# Altium schematic sheet T 1500  B.SchDoc
size 711 x 457 mm
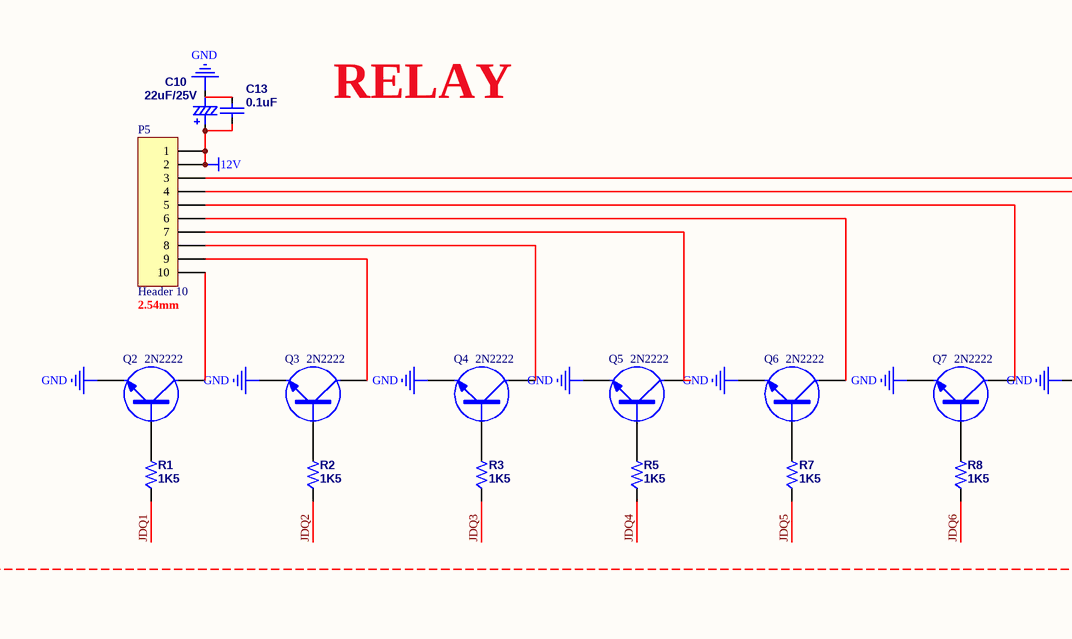
[diagram p0: T 1500  B.SchDoc, top left]
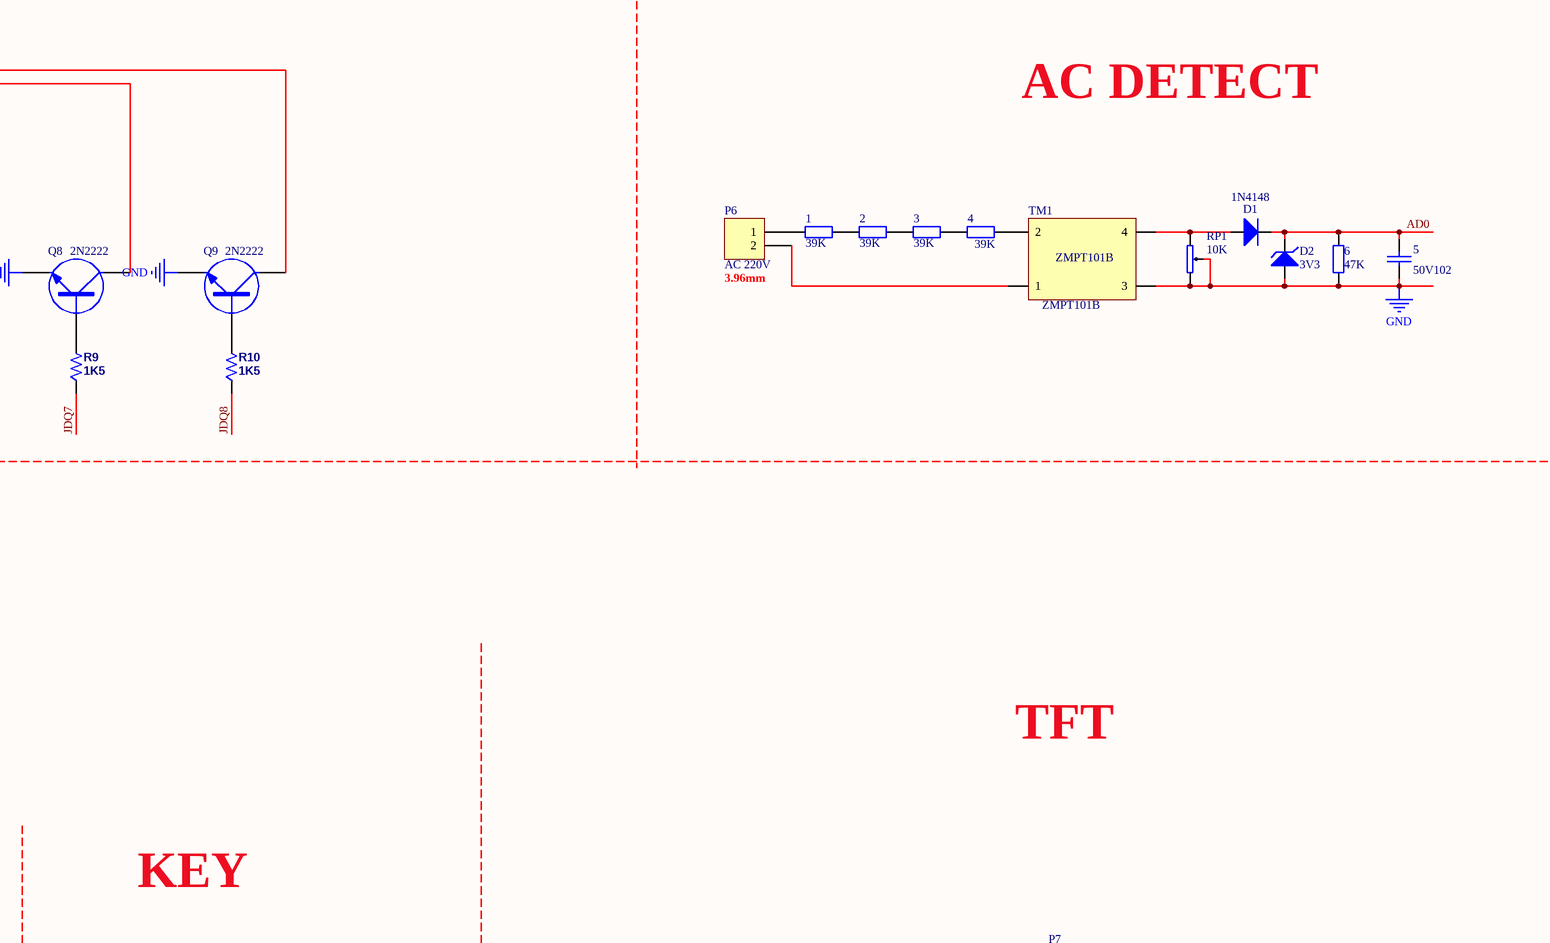
[diagram p1: T 1500  B.SchDoc, top right]
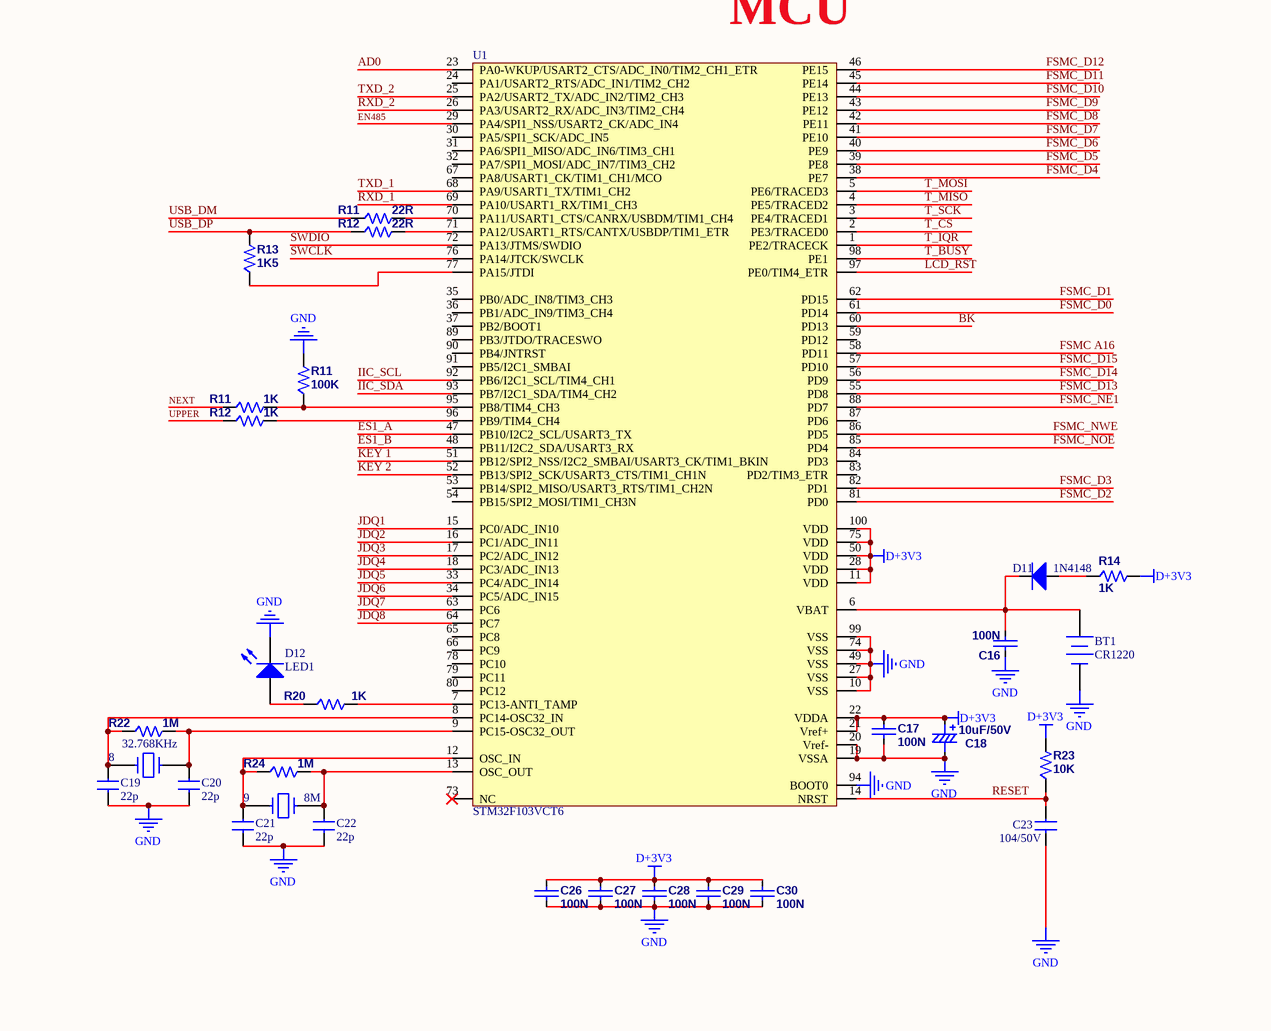
[diagram p2: T 1500  B.SchDoc, bottom left]
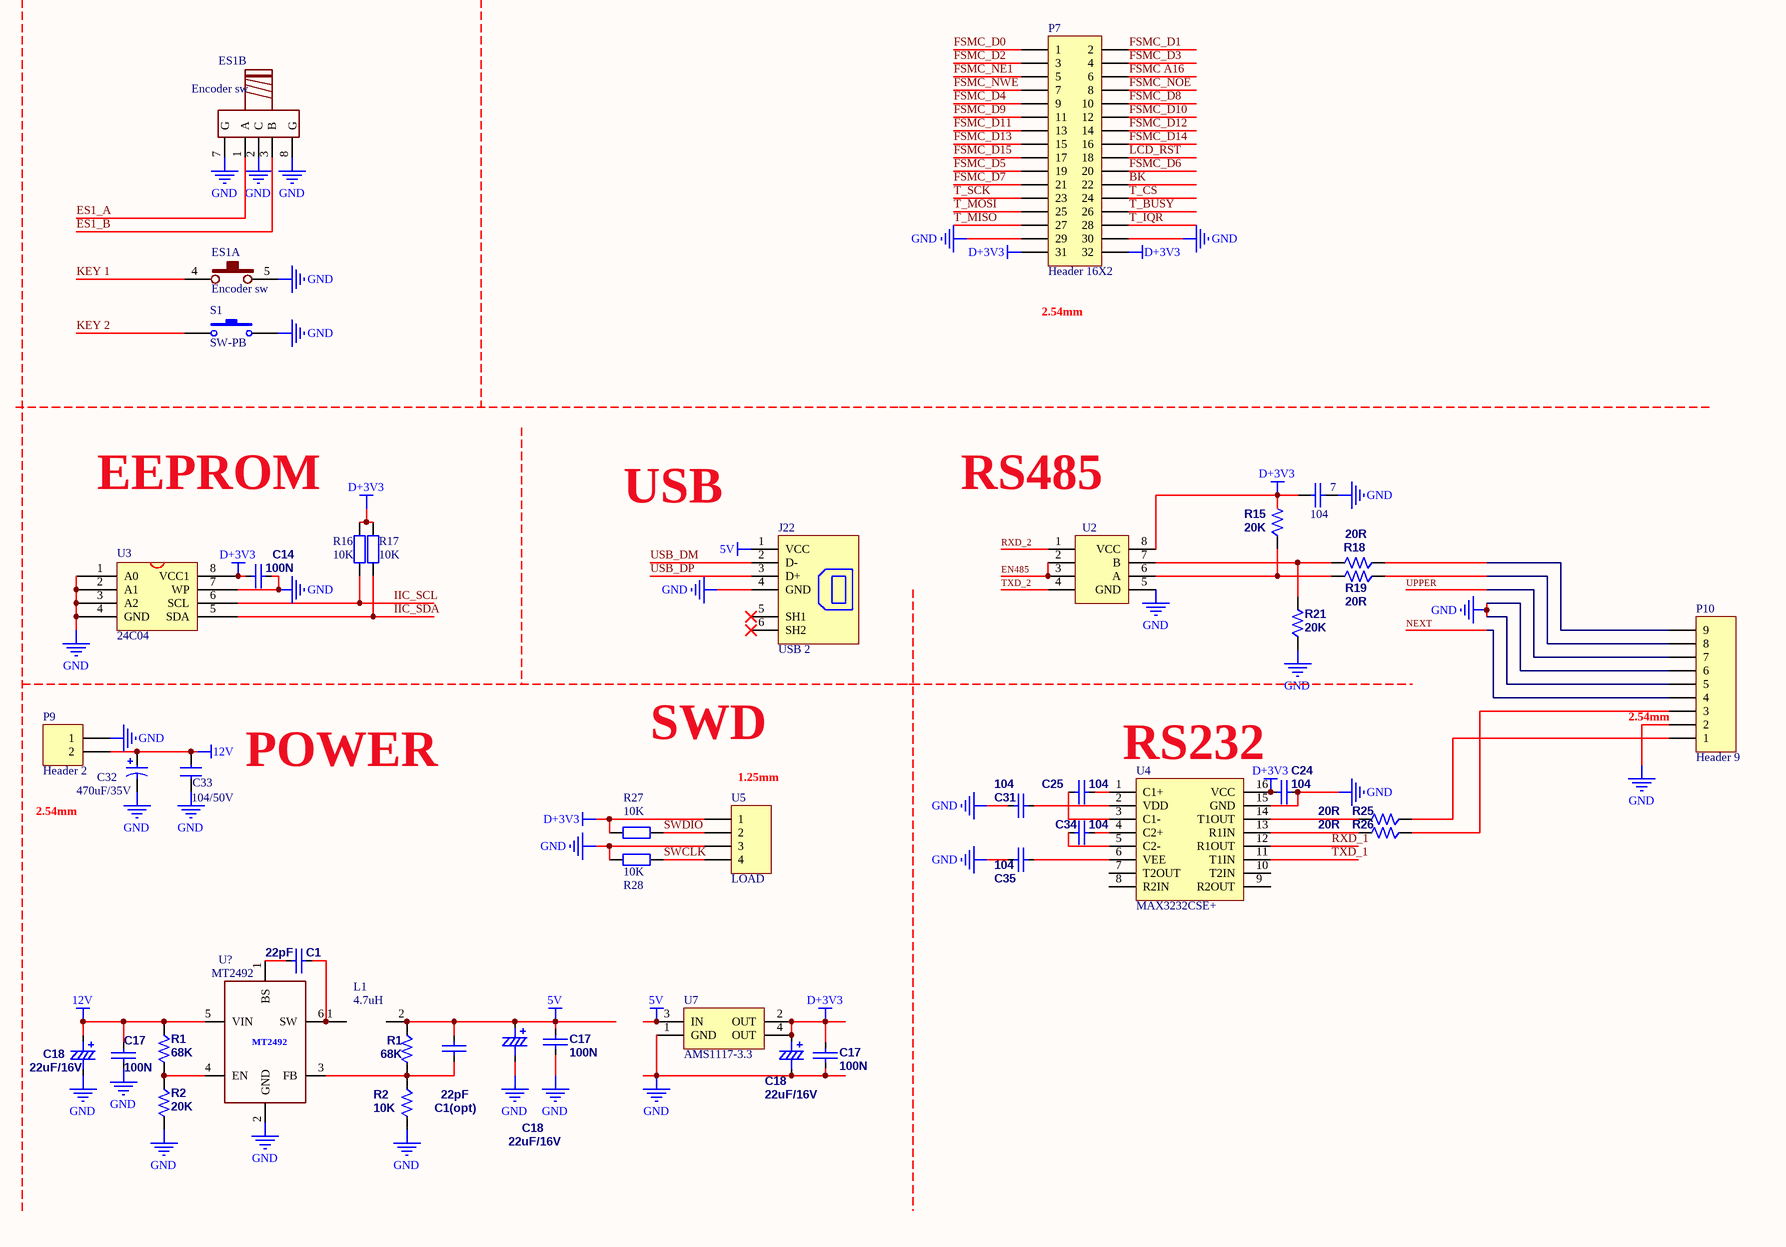
[diagram p3: T 1500  B.SchDoc, bottom right]

## Parts
(Parts that share a designator on the sheet are numbered #1, #2 ... from top to bottom, then left to right.)
1  39K  [R0805]
2  39K  [R0805]
3  39K  [R0805]
4  39K  [R0805]
5  50V102  [C0805]
6  47K  [R0805]
7  104  [C0805]
8  32.768KHz  [过孔晶振]
9  8M  [晶振 SMD  49]
BT1  CR1220  [BATM]
C1  22pF  [C0603]
C1(opt)  22pF  [C0603]
C10  22uF/25V  [CDO 0.26/0.26]
C13  0.1uF  [C0603]
C14  100N  [C0603]
C16  100N  [C0603]
C17#1  100N  [C0603]
C17#2  100N  [C0603]
C17#3  100N  [C0603]
C17#4  100N  [C0603]
C18#1  10uF/50V  [CDO 0.26/0.26]
C18#2  22uF/16V  [CDO 0.26/0.26]
C18#3  22uF/16V  [CDO 0.26/0.26]
C18#4  22uF/16V  [CDO 0.26/0.26]
C19  22p  [C0603]
C20  22p  [C0603]
C21  22p  [C0603]
C22  22p  [C0603]
C23  104/50V  [C0603]
C24  104  [C0603]
C25  104  [C0603]
C26  100N  [C0603]
C27  100N  [C0603]
C28  100N  [C0603]
C29  100N  [C0603]
C30  100N  [C0603]
C31  104  [C0603]
C32  470uF/35V  [CAP 10x5]
C33  104/50V  [C1206]
C34  104  [C0603]
C35  104  [C0603]
D1  1N4148  [LL 34]
D2  3V3  [LL 34]
D11  1N4148  [LL 34]
D12  LED1  [LED 0805]
ES1  Encoder sw  [编码开关]  (parts A,B of 2)
J22  USB 2  [USB 母座]
L1  4.7uH  [L1206]
P5  Header 10  [XH10A]
P6  AC 220V  [CH2P-3.96]
P7  Header 16X2  [HDR2X16]
P9  Header 2  [XH2A(2.54mm)]
P10  Header 9  [XH8A(2.54mm) - duplicate]
Q2  2N2222  [SOT-23]
Q3  2N2222  [SOT-23]
Q4  2N2222  [SOT-23]
Q5  2N2222  [SOT-23]
Q6  2N2222  [SOT-23]
Q7  2N2222  [SOT-23]
Q8  2N2222  [SOT-23]
Q9  2N2222  [SOT-23]
R1#1  1K5  [R0603]
R1#2  68K  [R0603]
R1#3  68K  [R0603]
R2#1  1K5  [R0603]
R2#2  20K  [R0603]
R2#3  10K  [R0603]
R3  1K5  [R0603]
R5  1K5  [R0603]
R7  1K5  [R0603]
R8  1K5  [R0603]
R9  1K5  [R0603]
R10  1K5  [R0603]
R11#1  22R  [R0603]
R11#2  1K  [R0603]
R11#3  100K  [R0603]
R12#1  22R  [R0603]
R12#2  1K  [R0603]
R13  1K5  [R0603]
R14  1K  [R0603]
R15  20K  [R0603]
R16  10K  [R0805]
R17  10K  [R0805]
R18  20R  [R0603]
R19  20R  [R0603]
R20  1K  [R0603]
R21  20K  [R0603]
R22  1M  [R0603]
R23  10K  [R0603]
R24  1M  [R0603]
R25  20R  [R0603]
R26  20R  [R0603]
R27  10K  [R0805]
R28  10K  [R0805]
RP1  10K  [SOT-23]
S1  SW-PB  [12*12*8.5轻触开关]
TM1  ZMPT101B  [ZMPT101B]
U1  STM32F103VCT6  [LQFP100]
U2  (no value)  [SOP-8]
U3  24C04  [SOP-8]
U4  MAX3232CSE+  [SOP-16]
U5  LOAD  [MHDR1X4]
U7  AMS1117-3.3  [SOT 223]
U?  MT2492

## Nets
5V: C1(opt).1 C17#2.1 C18#2.1(+) J22.1(VCC) L1.2 R1#3.1 U7.3(IN)
12V: C10.1(+) C13.1 C17#3.1 C18#3.1(+) C32.1 C33.2 P5.1 P5.2 P9.2 R1#2.1 U?.5(VIN)
D+3V3: 7.1 C14.1 C17#1.1 C17#4.1 C18#1.1(+) C18#4.1(+) C24.2 C26.1 C27.1 C28.1 C29.1 C30.1 P7.31 P7.32 R14.2 R15.2 R16.2 R17.2 R23.2 R27.1 U1.11(VDD) U1.21(Vref+) U1.22(VDDA) U1.28(VDD) U1.50(VDD) U1.75(VDD) U1.100(VDD) U2.8(VCC) U3.8(VCC1) U4.16(VCC) U5.1 U7.2(OUT) U7.4(OUT)
GND: 5.2 6.1 7.2 BT1.2(-) C10.2(G) C14.2 C16.2 C17#1.2 C17#2.2 C17#3.2 C17#4.2 C18#1.2(G) C18#2.2(G) C18#3.2(G) C18#4.2(G) C19.2 C20.2 C21.2 C22.2 C23.1 C24.1 C26.2 C27.2 C28.2 C29.2 C30.2 C31.2 C32.2 C33.1 C35.2 D2.1(A) D12.2(K) ES1.2(C) ES1.5(SW) ES1.7(G) ES1.8(G) J22.4(GND) P7.29 P7.30 P9.1 P10.2 P10.5 P10.6 Q2.3(E) Q3.3(E) Q4.3(E) Q5.3(E) Q6.3(E) Q7.3(E) Q8.3(E) Q9.3(E) R2#2.2 R2#3.2 R11#3.2 R21.1 R28.1 RP1.2 RP1.3 S1.2 TM1.3 U1.10(VSS) U1.19(VSSA) U1.20(Vref-) U1.27(VSS) U1.49(VSS) U1.74(VSS) U1.94(BOOT0) U1.99(VSS) U2.5(GND) U3.1(A0) U3.2(A1) U3.3(A2) U3.4(GND) U3.7(WP) U4.15(GND) U5.3 U7.1(GND) U?.2(GND)
AD0: 5.1 6.2 D1.2(K) D2.2(K) U1.23(PA0-WKUP/USART2_CTS/ADC_IN0/TIM2_CH1_ETR)
BK: P7.22 U1.60(PD13)
EN485: U1.29(PA4/SPI1_NSS/USART2_CK/ADC_IN4) U2.2 U2.3
ES1_A: ES1.1(A) U1.47(PB10/I2C2_SCL/USART3_TX)
ES1_B: ES1.3(B) U1.48(PB11/I2C2_SDA/USART3_RX)
FSMC A16: P7.6 U1.58(PD11)
FSMC_D0: P7.1 U1.61(PD14)
FSMC_D1: P7.2 U1.62(PD15)
FSMC_D2: P7.3 U1.81(PD0)
FSMC_D3: P7.4 U1.82(PD1)
FSMC_D4: P7.9 U1.38(PE7)
FSMC_D5: P7.19 U1.39(PE8)
FSMC_D6: P7.20 U1.40(PE9)
FSMC_D7: P7.21 U1.41(PE10)
FSMC_D8: P7.10 U1.42(PE11)
FSMC_D9: P7.11 U1.43(PE12)
FSMC_D10: P7.12 U1.44(PE13)
FSMC_D11: P7.13 U1.45(PE14)
FSMC_D12: P7.14 U1.46(PE15)
FSMC_D13: P7.15 U1.55(PD8)
FSMC_D14: P7.16 U1.56(PD9)
FSMC_D15: P7.17 U1.57(PD10)
FSMC_NE1: P7.5 U1.88(PD7)
FSMC_NOE: P7.8 U1.85(PD4)
FSMC_NWE: P7.7 U1.86(PD5)
IIC_SCL: R16.1 U1.92(PB6/I2C1_SCL/TIM4_CH1) U3.6(SCL)
IIC_SDA: R17.1 U1.93(PB7/I2C1_SDA/TIM4_CH2) U3.5(SDA)
JDQ1: R1#1.1 U1.15(PC0/ADC_IN10)
JDQ2: R2#1.1 U1.16(PC1/ADC_IN11)
JDQ3: R3.1 U1.17(PC2/ADC_IN12)
JDQ4: R5.1 U1.18(PC3/ADC_IN13)
JDQ5: R7.1 U1.33(PC4/ADC_IN14)
JDQ6: R8.1 U1.34(PC5/ADC_IN15)
JDQ7: R9.1 U1.63(PC6)
JDQ8: R10.1 U1.64(PC7)
KEY 1: ES1.4(SW) U1.51(PB12/SPI2_NSS/I2C2_SMBAI/USART3_CK/TIM1_BKIN)
KEY 2: S1.1 U1.52(PB13/SPI2_SCK/USART3_CTS/TIM1_CH1N)
LCD_RST: P7.18 U1.97(PE0/TIM4_ETR)
NEXT: P10.4 R11#2.1
RESET: C23.2 R23.1 U1.14(NRST)
RXD_1: U1.69(PA10/USART1_RX/TIM1_CH3) U4.12(R1OUT)
RXD_2: U1.26(PA3/USART2_RX/ADC_IN3/TIM2_CH4) U2.1
SWCLK: R28.2 U1.76(PA14/JTCK/SWCLK) U5.4
SWDIO: R27.2 U1.72(PA13/JTMS/SWDIO) U5.2
T_BUSY: P7.26 U1.98(PE1)
T_CS: P7.24 U1.2(PE3/TRACED0)
T_IQR: P7.28 U1.1(PE2/TRACECK)
T_MISO: P7.27 U1.4(PE5/TRACED2)
T_MOSI: P7.25 U1.5(PE6/TRACED3)
T_SCK: P7.23 U1.3(PE4/TRACED1)
TXD_1: U1.68(PA9/USART1_TX/TIM1_CH2) U4.11(T1IN)
TXD_2: U1.25(PA2/USART2_TX/ADC_IN2/TIM2_CH3) U2.4
UPPER: P10.7 R12#2.1
USB_DM: J22.2(D-) R11#1.1
USB_DP: J22.3(D+) R12#1.1 R13.2
Net1_1: 1.1 P6.1
Net1_2: 1.2 2.1
Net2_2: 2.2 3.1
Net3_2: 3.2 4.1
Net4_2: 4.2 TM1.2
Net8_1: 8.1 C19.1 R22.1 U1.8(PC14-OSC32_IN)
Net8_2: 8.2 C20.1 R22.2 U1.9(PC15-OSC32_OUT)
Net9_1: 9.1 C21.1 R24.1 U1.12(OSC_IN)
Net9_2: 9.2 C22.1 R24.2 U1.13(OSC_OUT)
NetBT1_1: BT1.1(+) C16.1 D11.2(K) U1.6(VBAT)
NetC1(opt)_2: C1(opt).2 R1#3.2 R2#3.1 U?.3(FB)
NetC1_1: C1.1 U?.1(BS)
NetC1_2: C1.2 L1.1 U?.6(SW)
NetC25_1: C25.1 U4.1(C1+)
NetC25_2: C25.2 U4.3(C1-)
NetC31_1: C31.1 U4.2(VDD)
NetC34_1: C34.1 U4.4(C2+)
NetC34_2: C34.2 U4.5(C2-)
NetC35_1: C35.1 U4.6(VEE)
NetD1_1: D1.1(A) RP1.1 TM1.4
NetD11_1: D11.1(A) R14.1
NetD12_1: D12.1(A) R20.1
NetP5_3: P5.3 Q9.2(C)
NetP5_4: P5.4 Q8.2(C)
NetP5_5: P5.5 Q7.2(C)
NetP5_6: P5.6 Q6.2(C)
NetP5_7: P5.7 Q5.2(C)
NetP5_8: P5.8 Q4.2(C)
NetP5_9: P5.9 Q3.2(C)
NetP5_10: P5.10 Q2.2(C)
NetP6_2: P6.2 TM1.1
NetP10_1: P10.1 R25.1
NetP10_3: P10.3 R26.1
NetP10_8: P10.8 R19.1
NetP10_9: P10.9 R18.1
NetQ2_1: Q2.1(B) R1#1.2
NetQ3_1: Q3.1(B) R2#1.2
NetQ4_1: Q4.1(B) R3.2
NetQ5_1: Q5.1(B) R5.2
NetQ6_1: Q6.1(B) R7.2
NetQ7_1: Q7.1(B) R8.2
NetQ8_1: Q8.1(B) R9.2
NetQ9_1: Q9.1(B) R10.2
NetR1#2_2: R1#2.2 R2#2.1 U?.4(EN)
NetR11#1_2: R11#1.2 U1.70(PA11/USART1_CTS/CANRX/USBDM/TIM1_CH4)
NetR11#2_2: R11#2.2 R11#3.1 U1.95(PB8/TIM4_CH3)
NetR12#1_2: R12#1.2 U1.71(PA12/USART1_RTS/CANTX/USBDP/TIM1_ETR)
NetR12#2_2: R12#2.2 U1.96(PB9/TIM4_CH4)
NetR13_1: R13.1 U1.77(PA15/JTDI)
NetR15_1: R15.1 R19.2 U2.6(A)
NetR18_2: R18.2 R21.2 U2.7(B)
NetR20_2: R20.2 U1.7(PC13-ANTI_TAMP)
NetR25_2: R25.2 U4.14(T1OUT)
NetR26_2: R26.2 U4.13(R1IN)

Not connected (* = marked no-connect by the designer): C13 2; J22 5(SH1)* 6(SH2)*; U1 24(PA1/USART2_RTS/ADC_IN1/TIM2_CH2) 30(PA5/SPI1_SCK/ADC_IN5) 31(PA6/SPI1_MISO/ADC_IN6/TIM3_CH1) 32(PA7/SPI1_MOSI/ADC_IN7/TIM3_CH2) 35(PB0/ADC_IN8/TIM3_CH3) 36(PB1/ADC_IN9/TIM3_CH4) 37(PB2/BOOT1) 53(PB14/SPI2_MISO/USART3_RTS/TIM1_CH2N) 54(PB15/SPI2_MOSI/TIM1_CH3N) 59(PD12) 65(PC8) 66(PC9) 67(PA8/USART1_CK/TIM1_CH1/MCO) 73(NC)* 78(PC10) 79(PC11) 80(PC12) 83(PD2/TIM3_ETR) 84(PD3) 87(PD6) 89(PB3/JTDO/TRACESWO) 90(PB4/JNTRST) 91(PB5/I2C1_SMBAI); U4 7(T2OUT) 8(R2IN) 9(R2OUT) 10(T2IN)

## Notes on the sheet
- RELAY
- AC DETECT
- (near P5) 2.54mm
- (near P6) 3.96mm
- TFT
- KEY
- (near U1) MCU
- 2.54mm
- EEPROM
- USB
- (near U2) RS485
- SWD
- (near P10) 2.54mm
- POWER
- (near U5) 1.25mm
- RS232

## Library data of the parts
1 3 4 6 R16 R17 R27 R28 = Res2: Resistor; Value: 1K; Published: 8-Jun-2000; LatestRevisionDate: 17-Jul-2002; LatestRevisionNote: Re-released for DXP Platform.; PackageReference: AXIAL-0.4; Publisher: Altium Limited
2 = Res2: Resistor; Published: *; LatestRevisionDate: *; LatestRevisionNote: *; PackageReference: *; Publisher: *; Value: *
5 7 = CAP: Capacitor
8 9 = CRYSTAL
BT1 = Battery: Multicell Battery; Published: 24-Mar-1999; LatestRevisionDate: 17-Jul-2002; LatestRevisionNote: Re-released for DXP Platform.; PackageReference: BAT-2; Publisher: Altium Limited; PackageDescription: Battery; 2 Leads
C1 C1(opt) C13 C14 C16 C17#1-C17#4 C24-C31 C34 C35 = CAP
C10 C18#1-C18#4 = ELECTRO2
C19-C23 C33 = CAP: 无极性电容器
C32 = CAP2: 有极性电容器
D1 D11 = 二极管 开关: 玻封二极管; Published: 8-Jun-2000; Revision: July-2002: Re-released for DXP Platform.; Publisher: Altium Limited
D2 = 二极管 稳压: 玻封二极管; Published: 8-Jun-2000; Revision: July-2002: Re-released for DXP Platform.; Publisher: Altium Limited
D12 = LED1: Typical RED GaAs LED; Published: 8-Jun-2000; LatestRevisionDate: 08-Jul-2005; LatestRevisionNote: Mech Layer 1 removed.; PackageReference: LED-1; Publisher: Altium Limited; PackageDescription: LED; 2 Leads
J22 = USB  2
L1 = Inductor
P5 = Header 10: Header, 10-Pin; LatestRevisionDate: 17-Jul-2002; LatestRevisionNote: Re-released for DXP Platform.; Publisher: Altium Limited
P6 P9 = Header 2: Header, 2-Pin; LatestRevisionDate: 17-Jul-2002; LatestRevisionNote: Re-released for DXP Platform.; Publisher: Altium Limited
P7 = Header 16X2: Header, 16-Pin, Dual row; LatestRevisionDate: 17-Jul-2002; LatestRevisionNote: Re-released for DXP Platform.; Publisher: Altium Limited
P10 = Header 9: Header, 9-Pin; LatestRevisionDate: 17-Jul-2002; LatestRevisionNote: Re-released for DXP Platform.; Publisher: Altium Limited
Q2-Q9 = NPN: NPN Transistor
R1#1-R1#3 R2#1-R2#3 R3 R5 R7-R10 R11#1-R11#3 R12#1 R12#2 R13-R15 R18-R26 = RES2-S
RP1 = RP1: 电阻
S1 = SW-PB: Switch; Published: 24-Mar-1999; LatestRevisionDate: 17-Jul-2002; LatestRevisionNote: Re-released for DXP Platform.; PackageReference: SPST-2; Publisher: Altium Limited; PackageDescription: Switch; 2 Leads
U1 = STM32F103V8T6
U2 = MAX485
U3 = 24C256
U4 = MAX232: +5V Powered, Multi-Channel RS-232 Driver/Receiver
U5 = MHDR1X4: Header, 4-Pin; LatestRevisionDate: 17-Jul-2002; LatestRevisionNote: Re-released for DXP Platform.; Publisher: Altium Limited
U7 = LD1117: 1.25-15V/800mA稳压器